# Altium project Audio_Mini.PrjPcb (part 3 of 3)

## Sheet Power.SchDoc: Power Regulation
size 279 x 215 mm; DrawnBy: Connor Dack; Engineer: Connor Dack; DocumentNumber: 7; Revision: 1.0; SheetNumber: 7; SheetTotal: 11
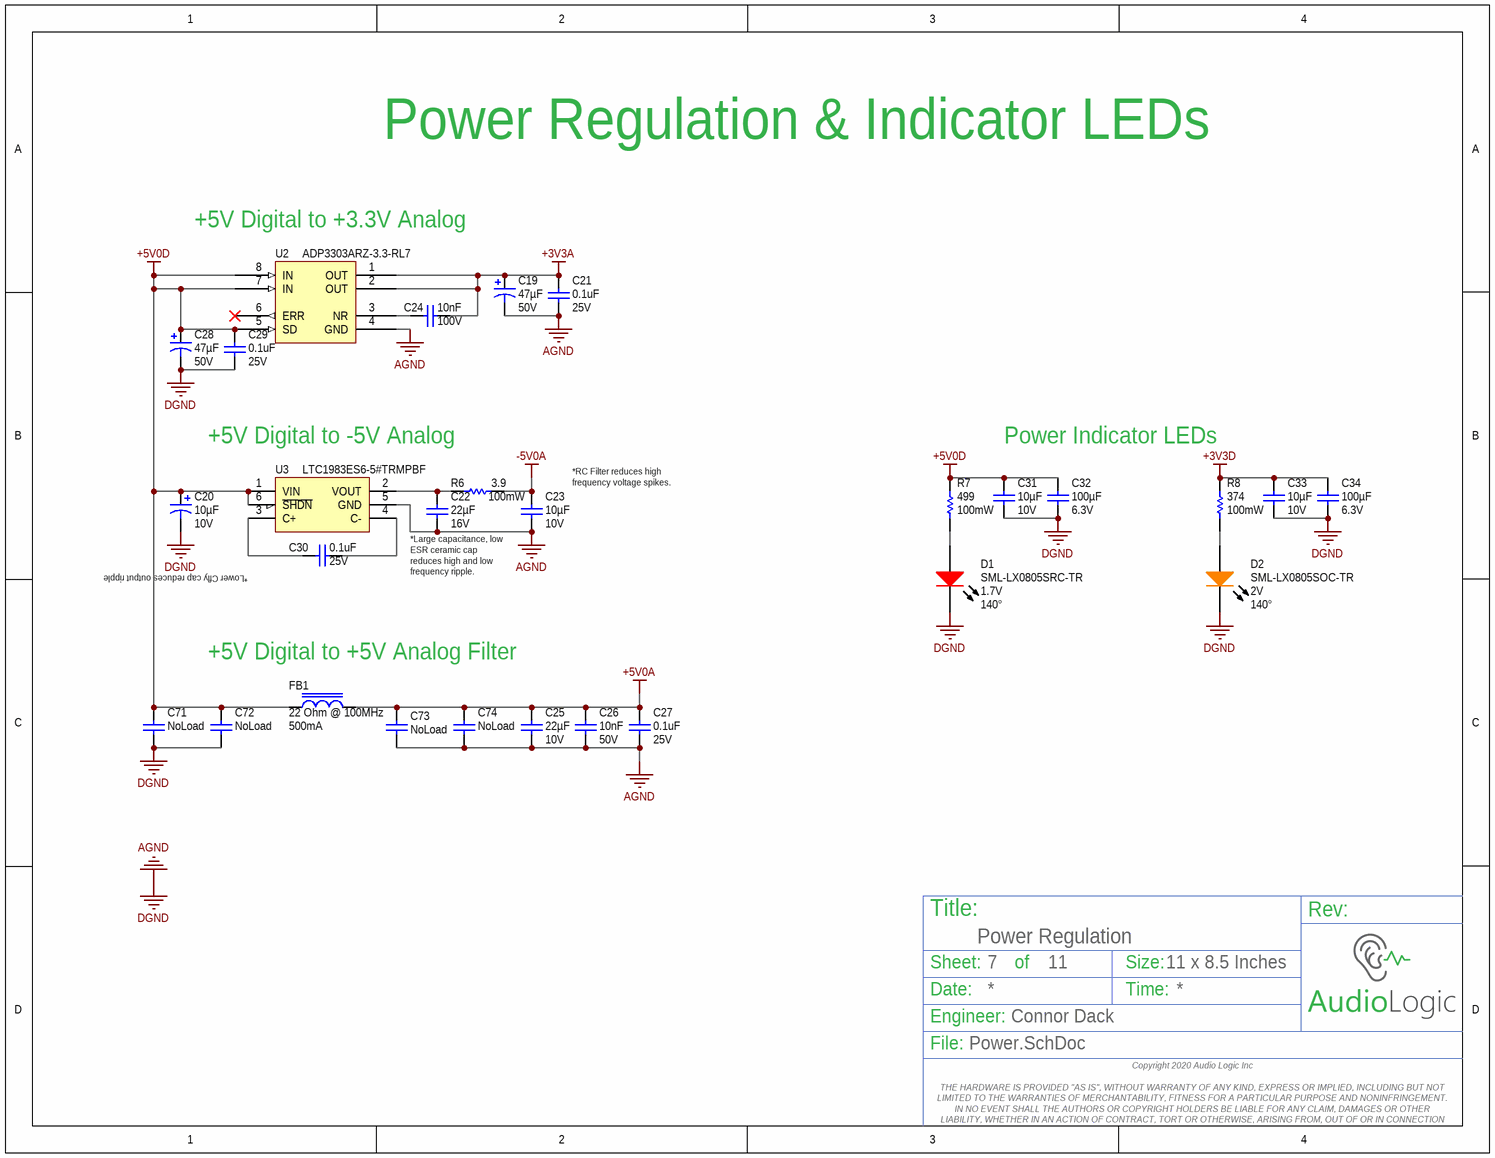
[diagram p9: Power.SchDoc]

### Parts
C19  Voltage Rating: 50V  Capacitance: 47µF  [ALUMCAPC630D_D]  (hidden comment: EEE-FT1H470AP)
C20  Voltage - Rated: 10V  Capacitance: 10µF  [C1206_TANT]  (hidden comment: TPSA106K010R0900)
C21  Voltage Rating: 25V  Capacitance: 0.1uF  [3-0603_L]  (hidden comment: CGA3E2X7R1E104K080AA)
C22  Voltage - Rated: 16V  Capacitance: 22µF  [C1206]  (hidden comment: C3216X6S1C226M)
C23  Voltage - Rated: 10V  Capacitance: 10µF  [3-0603_L]  (hidden comment: C1608X5R1A106K)
C24  Voltage - Rated: 100V  Capacitance: 10nF  [3-0603_L]  (hidden comment: C1608X7R2A103K080AA)
C25  Voltage - Rated: 10V  Capacitance: 22µF  [6-0805_L]  (hidden comment: CL21A226KPCLRNC)
C26  Voltage - Rated: 50V  Capacitance: 10nF  [3-0603_L]  (hidden comment: C0603C103J5RACTU)
C27  Voltage Rating: 25V  Capacitance: 0.1uF  [3-0603_L]  (hidden comment: CGA3E2X7R1E104K080AA)
C28  Voltage Rating: 50V  Capacitance: 47µF  [ALUMCAPC630D_D]  (hidden comment: EEE-FT1H470AP)
C29  Voltage Rating: 25V  Capacitance: 0.1uF  [3-0603_L]  (hidden comment: CGA3E2X7R1E104K080AA)
C30  Voltage Rating: 25V  Capacitance: 0.1uF  [3-0603_L]  (hidden comment: CGA3E2X7R1E104K080AA)
C31  Voltage - Rated: 10V  Capacitance: 10µF  [3-0603_L]  (hidden comment: C1608X5R1A106K)
C32  Voltage - Rated: 6.3V  Capacitance: 100µF  [C1210X25_L]  (hidden comment: CL32X107MQVNNNE)
C33  Voltage - Rated: 10V  Capacitance: 10µF  [3-0603_L]  (hidden comment: C1608X5R1A106K)
C34  Voltage - Rated: 6.3V  Capacitance: 100µF  [C1210X25_L]  (hidden comment: CL32X107MQVNNNE)
C71  Capacitance: NoLoad  [3-0603_L_DNP]  (hidden comment: CAP 0603)
C72  Capacitance: NoLoad  [3-0603_L_DNP]  (hidden comment: CAP 0603)
C73  Capacitance: NoLoad  [3-0603_L_DNP]  (hidden comment: CAP 0603)
C74  Capacitance: NoLoad  [3-0603_L_DNP]  (hidden comment: CAP 0603)
D1  Manufacturer Part Number: SML-LX0805SRC-TR  Voltage - Forward (Vf) (Typ): 1.7V  Viewing Angle: 140°  [DIOM2012X12L_RED]  (hidden comment: LED_RED 4)
D2  Manufacturer Part Number: SML-LX0805SOC-TR  Voltage - Forward (Vf) (Typ): 2V  Viewing Angle: 140°  [DIOM2012X12L_ORANGE]  (hidden comment: LED_ORANGE 3)
FB1  Current Rating: 500mA  Impedance @ Frequency: 22 Ohm @ 100MHz  [3-0603_L]  (hidden comment: BLM18BA220SN1D)
R6  Power (Watts): 100mW  Resistance (Ohms): 3.9  [3-0603_R_L]  (hidden comment: ERJ-3RQF3R9V)
R7  Power (Watts): 100mW  Resistance (Ohms): 499  [3-0603_R_L]  (hidden comment: ERJ-3EKF4990V)
R8  Power (Watts): 100mW  Resistance (Ohms): 374  [3-0603_R_L]  (hidden comment: ERJ-3EKF3740V)
U2  ADP3303ARZ-3.3-RL7  [SOIC127P600X175-8N]
U3  (no value)  [SOT23-6_L]

### Nets
+3V3A: C19.1(P) C21.1 C24.1 U2.1(OUT) U2.2(OUT)
+3V3D: C33.2 C34.2 R8.2
+5V0A: C25.2 C26.2 C27.1 C73.2 C74.2 FB1.2
+5V0D: C20.1(P) C28.1(P) C29.1 C31.2 C32.2 C71.2 C72.2 FB1.1 R7.2 U2.5(SD) U2.7(IN) U2.8(IN) U3.1(VIN) U3.6(~{SHDN})
-5V0A: C23.2 R6.2
AGND: C19.2(N) C20.2(N) C21.2 C22.1 C23.1 C25.1 C26.1 C27.2 C28.2(N) C29.2 C31.1 C32.1 C33.1 C34.1 C71.1 C72.1 C73.1 C74.1 D1.2(K) D2.2(K) U2.4(GND) U3.5(GND)  [also labelled DGND]
NetC22_2: C22.2 R6.1 U3.2(VOUT)
NetC24_2: C24.2 U2.3(NR)
NetC30_1: C30.1 U3.4(C-)
NetC30_2: C30.2 U3.3(C+)
NetD1_1: D1.1(A) R7.1
NetD2_1: D2.1(A) R8.1

Not connected (* = marked no-connect by the designer): U2 6(ERR)*

### Notes on the sheet
- Power Regulation & Indicator LEDs
- +5V Digital to +3.3V Analog
- +5V Digital to -5V Analog
- (near C23) *RC Filter reduces high frequency voltage spikes.
- Power Indicator LEDs
- (near C30) *Lower Cfly cap reduces output ripple
- (near C22) *Large capacitance, low ESR ceramic cap reduces high and low frequency ripple.
- +5V Digital to +5V Analog Filter
- Title:
- Sheet:
- of
- Size:
- 11 x 8.5 Inches
- Rev:
- Date:
- Engineer:
- Time:
- File:
- Copyright 2020 Audio Logic Inc
  THE HARDWARE IS PROVIDED "AS IS", WITHOUT WARRANTY OF ANY KIND, EXPRESS OR IMPLIED, INCLUDING BUT NOT LIMITED TO THE WARRANTIES OF MERCHANTABILITY, FITNESS FOR A PARTICULAR PURPOSE AND NONINFRINGEMENT. IN NO EVENT SHALL THE AUTHORS OR COPYRIGHT HOLDERS BE LIABLE FOR ANY CLAIM, DAMAGES OR OTHER LIABILITY, WHETHER IN AN ACTION OF CONTRACT, TORT OR OTHERWISE, ARISING FROM, OUT OF OR IN CONNECTION WITH THE HARDWARE OR THE USE OR OTHER DEALINGS IN THE HARDWARE.

### Library data of the parts
C19 C28 = EEE-FT1H470AP: CAP ALUM 47UF 50V 20% SMD; Manufacturer: Panasonic - ECG; Lifetime @ Temp.: 2000 Hrs @ 105°C; Ripple Current: 195mA; ESR (Equivalent Series Resistance): 680.0 mOhm; Surface Mount Land Size: 0.260" L x 0.260" W (6.60mm x 6.60mm); Supplier 1: Digi-Key; Manufacturer Part Number: EEE-FT1H470AP; RoHS: RoHS Compliant; Category: Capacitors; Stock 1: 1772; Pricing 1: 1=0.81, 50=0.4834, 100=0.4229, 250=0.33232, 500=0.3021 (USD); Tolerance: ±20%; Operating Temperature: -55°C ~ 105°C; Features: General Purpose; Impedance: -; Mounting Type: Surface Mount; Package / Case: Radial, Can - SMD; Size / Dimension: 0.248" Dia (6.30mm); Height - Seated (Max): 0.240" (6.10mm); Lead Spacing: -; Packaging: Cut Tape (CT); ComponentLink1URL: http://industrial.panasonic.com/www-cgi/jvcr17pz.cgi?E+PZ+4+ABA0134+0+WW; ComponentLink1Description: http://industrial.panasonic.com/www-cgi/jvcr17pz.cgi?E+PZ+4+ABA0134+0+WW; Supplier Part Number 1: PCE5023CT-ND; Load Status: *
C20 = TPSA106K010R0900: CAP TANT 10UF 10V 10% 1206; Manufacturer: AVX Corporation; Manufacturer Size Code: A; ESR (Equivalent Series Resistance): 900 mOhm; Type: Molded; Supplier 1: Digi-Key; Manufacturer Part Number: TPSA106K010R0900; RoHS: RoHS Compliant; Category: Capacitors; Stock 1: 62197; Pricing 1: 1=0.77, 10=0.737, 100=0.3575, 250=0.297, 500=0.2695, 1000=0.2475 (USD); Packaging: Cut Tape (CT); Tolerance: ±10%; Operating Temperature: -55°C ~ 125°C; Mounting Type: Surface Mount; Package / Case: 1206 (3216 Metric); Size / Dimension: 0.126" L x 0.063" W (3.20mm x 1.60mm); Height - Seated (Max): 0.071" (1.80mm); Lead Spacing: -; Features: General Purpose; Lifetime @ Temp.: -; ComponentLink1URL: http://www.avx.com/docs/Catalogs/tps.pdf; ComponentLink1Description: http://www.avx.com/docs/Catalogs/tps.pdf; Supplier Part Number 1: 478-1751-1-ND; Load Status: *
C21 C27 C29 C30 = CGA3E2X7R1E104K080AA: CAP CER 0.1UF 25V X7R 0603; Manufacturer: TDK; Tolerance: 10%; ComponentLink1URL: https://datasheet.ciiva.com/24218/cga3e2x7r1h332k080aa-266003-24218741.pdf; ComponentLink1Description: https://datasheet.ciiva.com/24218/cga3e2x7r1h332k080aa-266003-24218741.pdf; Supplier 1: Digi-Key; Manufacturer Part Number: CGA3E2X7R1E104K080AA; Stock 1: 170098; Pricing 1: 1=0.1, 10=0.063, 100=0.0279, 500=0.0199, 1000=0.0156 (USD); Mount: Surface Mount; Case/Package: 0603; Weight: 7.1E-05oz; Case Code (Metric): 1608; Case Code (Imperial): 0603; Min Operating Temperature: -55°C; Max Operating Temperature: 125°C; Packaging: Tape and Reel; Package Quantity: 1; Voltage Rating (DC): 25V; Dielectric: X7R; Termination: SMD/SMT; Composition: Ceramic; Length: 1.6mm; Height: 0.8mm; Width: 0.031inch; Thickness: 0.035inch; Depth: 0.8mm; REACH SVHC: No SVHC; Lead Free: Lead Free; ComponentLink2URL: https://datasheet.ciiva.com/22725/1735392-22725638.pdf; ComponentLink2Description: https://datasheet.ciiva.com/22725/1735392-22725638.pdf; ComponentLink3URL: https://datasheet.ciiva.com/24220/cga3e2x7r1e104k080aa-265934-24220022.pdf; ComponentLink3Description: https://datasheet.ciiva.com/24220/cga3e2x7r1e104k080aa-265934-24220022.pdf; ComponentLink4URL: https://datasheet.ciiva.com/22725/1735392-22725639.pdf; ComponentLink4Description: https://datasheet.ciiva.com/22725/1735392-22725639.pdf; ComponentLink5URL: https://datasheet.ciiva.com/16427/mlccspec-automotive-general-midvoltage-en-16427320.pdf; ComponentLink5Description: https://datasheet.ciiva.com/16427/mlccspec-automotive-general-midvoltage-en-16427320.pdf; ComponentLink6URL: https://datasheet.ciiva.com/23803/1735392-23803082.pdf; ComponentLink6Description: https://datasheet.ciiva.com/23803/1735392-23803082.pdf; Supplier Part Number 1: 445-5667-6-ND
C22 = C3216X6S1C226M: CAP CER 22UF 16V 20% X6S 1206; Manufacturer: TDK Corporation; Supplier 1: Digi-Key; Manufacturer Part Number: C3216X6S1C226M; RoHS: RoHS Compliant; Category: Capacitors; Stock 1: 4138; Pricing 1: 1=1.13, 10=0.94, 100=0.6, 250=0.5, 500=0.45, 1000=0.41 (USD); Tolerance: ±20%; Temperature Coefficient: X6S; Mounting Type: Surface Mount, MLCC; Operating Temperature: -55°C ~ 105°C; Applications: General Purpose; Ratings: -; Package / Case: 1206 (3216 Metric); Size / Dimension: 0.126" L x 0.063" W (3.20mm x 1.60mm); Height - Seated (Max): -; Thickness (Max): -; Lead Spacing: -; Features: -; Packaging: Cut Tape (CT); Lead Style: -; ComponentLink1URL: http://www.tdk.com/pdf/general_B11.pdf; ComponentLink1Description: http://www.tdk.com/pdf/general_B11.pdf; Supplier Part Number 1: 445-8044-1-ND; Load Status: *
C23 C31 C33 = C1608X5R1A106K: CAP CER 10UF 10V 10% X5R 0603; Manufacturer: TDK Corporation; Supplier 1: Digi-Key; Manufacturer Part Number: C1608X5R1A106K; RoHS: RoHS Compliant; Category: Capacitors; Stock 1: 36523; Pricing 1: 1=0.48, 10=0.42, 100=0.21, 250=0.168, 500=0.153, 1000=0.138 (USD); Tolerance: ±10%; Temperature Coefficient: X5R; Mounting Type: Surface Mount, MLCC; Operating Temperature: -55°C ~ 85°C; Applications: General Purpose; Ratings: -; Package / Case: 0603 (1608 Metric); Size / Dimension: 0.063" L x 0.031" W (1.60mm x 0.80mm); Height - Seated (Max): -; Thickness (Max): 0.035" (0.90mm); Lead Spacing: -; Features: -; Packaging: Cut Tape (CT); Lead Style: -; ComponentLink1URL: http://www.tdk.com/pdf/general_B11.pdf; ComponentLink1Description: http://www.tdk.com/pdf/general_B11.pdf; Supplier Part Number 1: 445-7486-1-ND; Load Status: *
C24 = C1608X7R2A103K080AA: CAP CER 10000PF 100V X7R 0603; Manufacturer: TDK Corporation; Tolerance: ±10%; Supplier 1: Digi-Key; Manufacturer Part Number: C1608X7R2A103K080AA; RoHS: RoHS Compliant; Category: Capacitors; Stock 1: 257721; Pricing 1: 1=0.1, 10=0.06, 100=0.0275, 250=0.02252, 500=0.01926, 1000=0.015 (USD); Packaging: Cut Tape (CT); Temperature Coefficient: X7R; Mounting Type: Surface Mount, MLCC; Operating Temperature: -55°C ~ 125°C; Applications: General Purpose; Ratings: -; Package / Case: 0603 (1608 Metric); Size / Dimension: 0.063" L x 0.031" W (1.60mm x 0.80mm); Height - Seated (Max): -; Thickness (Max): 0.037" (0.95mm); Lead Spacing: -; Features: -; Lead Style: -; ComponentLink1URL: http://product.tdk.com/capacitor/mlcc/en/documents/mlcc_commercial_midvoltage_en.pdf; ComponentLink1Description: http://product.tdk.com/capacitor/mlcc/en/documents/mlcc_commercial_midvoltage_en.pdf; Supplier Part Number 1: 445-1304-1-ND; Load Status: *
C25 = CL21A226KPCLRNC: CAP CER 22UF 10V X5R 0805; Manufacturer: Samsung Electro-Mechanics America, Inc.; Tolerance: ±10%; Supplier 1: Digi-Key; Manufacturer Part Number: CL21A226KPCLRNC; RoHS: RoHS Compliant; Category: Capacitors; Stock 1: 70317; Pricing 1: 1=0.25, 10=0.173, 25=0.1384, 50=0.1154, 100=0.0981, 250=0.07788, 500=0.06924, 1000=0.06059 (USD); Packaging: Cut Tape (CT); Part Status: Active; Temperature Coefficient: X5R; Operating Temperature: -55°C ~ 85°C; Features: Low Profile; Ratings: -; Applications: General Purpose; Failure Rate: *; Mounting Type: Surface Mount, MLCC; Package / Case: 0805 (2012 Metric); Size / Dimension: 0.079" L x 0.049" W (2.00mm x 1.25mm); Height - Seated (Max): -; Thickness (Max): 0.037" (0.95mm); Lead Spacing: -; Lead Style: -; ComponentLink1URL: http://www.samsungsem.com/kr/support/product-search/mlcc/__icsFiles/afieldfile/2016/08/18/S_CL21A226KPCLRNC.pdf; ComponentLink1Description: http://www.samsungsem.com/kr/support/product-search/mlcc/__icsFiles/afieldfile/2016/08/18/S_CL21A226KPCLRNC.pdf; Supplier Part Number 1: 1276-6786-1-ND; Load Status: *
C26 = C0603C103J5RACTU: CAP CER 10000PF 50V 5% X7R 0603; Manufacturer: Kemet; Supplier 1: Digi-Key; Manufacturer Part Number: C0603C103J5RACTU; RoHS: RoHS Compliant; Category: Capacitors; Stock 1: 187680; Pricing 1: 1=0.1, 10=0.036, 50=0.0196, 100=0.0165, 250=0.01352, 500=0.01156, 1000=0.009 (USD); Tolerance: ±5%; Temperature Coefficient: X7R; Mounting Type: Surface Mount, MLCC; Operating Temperature: -55°C ~ 125°C; Applications: General Purpose; Ratings: -; Package / Case: 0603 (1608 Metric); Size / Dimension: 0.063" L x 0.031" W (1.60mm x 0.80mm); Height - Seated (Max): -; Thickness (Max): 0.034" (0.87mm); Lead Spacing: -; Features: -; Packaging: Cut Tape (CT); Lead Style: -; ComponentLink1URL: http://www.kemet.com/datasheets&C0603C103J5RACTU; ComponentLink1Description: http://www.kemet.com/datasheets&C0603C103J5RACTU; Supplier Part Number 1: 399-1092-1-ND; Load Status: *
C32 C34 = CL32X107MQVNNNE: 100µF 6.3V Ceramic Capacitor X6S 1210 (3225 Metric) 0.126" L x 0.098" W (3.20mm x 2.50mm); Manufacturer: Samsung Electro-Mechanics America, Inc.; Tolerance: ±20%; Supplier 1: Digi-Key; Manufacturer Part Number: CL32X107MQVNNNE; RoHS: RoHS Compliant; Category: Capacitors; Stock 1: 19666; Pricing 1: 1=1.35, 10=1.13, 25=0.974, 50=0.914, 100=0.7215, 500=0.54112 (USD); Packaging: Cut Tape (CT); Part Status: Active; Temperature Coefficient: X6S; Mounting Type: Surface Mount, MLCC; Operating Temperature: -55°C ~ 105°C; Applications: General Purpose; Ratings: -; Package / Case: 1210 (3225 Metric); Size / Dimension: 0.126" L x 0.098" W (3.20mm x 2.50mm); Height - Seated (Max): -; Thickness (Max): 0.110" (2.80mm); Lead Spacing: -; Features: -; Lead Style: -; ComponentLink1URL: http://www.samsungsem.com/kr/front/downloadcms.do?path=/kr/support/product-search/mlcc/__icsFiles/afieldfile/2014/11/05&fileName=C_CL32X107MQVNNNE.pdf; ComponentLink1Description: http://www.samsungsem.com/kr/front/downloadcms.do?path=/kr/support/product-search/mlcc/__icsFiles/afieldfile/2014/11/05&fileName=C_CL32X107MQVNNNE.pdf; Supplier Part Number 1: 1276-3399-1-ND; Load Status: *
C71-C74 = CAP 0603: CAP 0603 SMD - NoLoad; Load Status: Do Not Install
D1 = LED_RED 4: LED 660NM SUPER RED CLR 0805 T/R; Manufacturer: Lumex Opto/Components Inc; Millicandela Rating: 25mcd; Current - Test: 20mA; Lens Type: Clear; Supplier 1: Digi-Key; RoHS: RoHS Compliant; Category: Optoelectronics; Stock 1: 1141; Pricing 1: 1=0.56, 10=0.395, 100=0.2596, 250=0.19472, 500=0.177, 1000=0.1416 (USD); Packaging: Cut Tape (CT); Color: Red; Wavelength - Dominant: -; Wavelength - Peak: 660nm; Lens Style/Size: *; Package / Case: 0805 (2012 Metric); Size / Dimension: 2.00mm L x 1.25mm W; Height: 1.10mm; Mounting Type: Surface Mount; Luminous Flux @ Current - Test: -; ComponentLink1URL: http://www.lumex.com/specs/SML-LX0805SRC-TR.pdf; ComponentLink1Description: http://www.lumex.com/specs/SML-LX0805SRC-TR.pdf; Supplier Part Number 1: 67-2191-1-ND; Load Status: *
D2 = LED_ORANGE 3: LED 610NM SUPER ORANGE 0805 SMD; Manufacturer: Lumex Opto/Components Inc; Millicandela Rating: 60mcd; Current - Test: 20mA; Lens Type: Clear; Lens Style/Size: Rectangle with Flat Top, 1.4mm x 1.25mm; Supplier 1: Digi-Key; RoHS: RoHS Compliant; Category: Optoelectronics; Stock 1: 13373; Pricing 1: 1=0.65, 10=0.502, 100=0.3255, 250=0.279, 500=0.2418, 1000=0.186 (USD); Packaging: Cut Tape (CT); Color: Orange; Wavelength - Dominant: -; Wavelength - Peak: 610nm; Package / Case: 0805 (2012 Metric); Size / Dimension: 2.00mm L x 1.25mm W; Height: 1.10mm; Mounting Type: Surface Mount; Luminous Flux @ Current - Test: -; ComponentLink1URL: http://www.lumex.com/specs/SML-LX0805SOC-TR.pdf; ComponentLink1Description: http://www.lumex.com/specs/SML-LX0805SOC-TR.pdf; Supplier Part Number 1: 67-1637-1-ND; Load Status: *
FB1 = BLM18BA220SN1D: FERRITE CHIP 22 OHM 500MA 0603; Manufacturer: Murata Electronics North America; DC Resistance (DCR): 350 mOhm Max; Filter Type: Differential Mode - Single; Supplier 1: Digi-Key; Manufacturer Part Number: BLM18BA220SN1D; RoHS: RoHS Compliant; Category: Filters; Stock 1: 10969; Pricing 1: 1=0.24, 10=0.18, 50=0.105, 100=0.084, 250=0.06, 500=0.0408, 1000=0.033 (USD); Package / Case: 0603 (1608 Metric); Mounting Type: Surface Mount; Packaging: Cut Tape (CT); Height (Max): 0.037" (0.95mm); Size / Dimension: 0.063" L x 0.031" W (1.60mm x 0.80mm); ComponentLink1URL: http://search.murata.co.jp/Ceramy/image/img/PDF/ENG/L0110S0100BLM18B.pdf; ComponentLink1Description: http://search.murata.co.jp/Ceramy/image/img/PDF/ENG/L0110S0100BLM18B.pdf; Supplier Part Number 1: 490-1016-1-ND; Load Status: *
R6 = ERJ-3RQF3R9V: RES 3.9 OHM 1/10W 1% 0603 SMD; Manufacturer: Panasonic Electronic Components; Temperature Coefficient: ±200ppm/°C; Supplier 1: Digi-Key; Manufacturer Part Number: ERJ-3RQF3R9V; RoHS: RoHS Compliant; Category: Resistors; Stock 1: 44573; Pricing 1: 1=0.29, 50=0.1138, 100=0.0878, 250=0.06824, 500=0.0481, 1000=0.0351 (USD); Packaging: Cut Tape (CT); Tolerance: ±1%; Composition: Thick Film; Features: -; Package / Case: 0603 (1608 Metric); Supplier Device Package: 0603; Size / Dimension: 0.063" L x 0.031" W (1.60mm x 0.80mm); Height: 0.022" (0.55mm); Number of Terminations: 2; ComponentLink1URL: http://industrial.panasonic.com/www-cgi/jvcr13pz.cgi?E+PZ+3+AOA0003+ERJ3RQF3R9V+7+WW; ComponentLink1Description: http://industrial.panasonic.com/www-cgi/jvcr13pz.cgi?E+PZ+3+AOA0003+ERJ3RQF3R9V+7+WW; Supplier Part Number 1: P3.9AJCT-ND; Load Status: *
R7 = ERJ-3EKF4990V: RES 499 OHM 1/10W 1% 0603 SMD; Manufacturer: Panasonic - ECG; Temperature Coefficient: ±100ppm/°C; Supplier 1: Digi-Key; Manufacturer Part Number: ERJ-3EKF4990V; RoHS: RoHS Compliant; Category: Resistors; Stock 1: 748630; Pricing 1: 1=0.1, 50=0.0138, 100=0.0105, 250=0.0078, 500=0.00576, 1000=0.00384 (USD); Composition: Thick Film; Features: -; Tolerance: ±1%; Package / Case: 0603 (1608 Metric); Size / Dimension: 0.063" L x 0.031" W (1.60mm x 0.80mm); Height: 0.022" (0.55mm); Number of Terminations: 2; Packaging: Cut Tape (CT); ComponentLink1URL: http://industrial.panasonic.com/www-cgi/jvcr13pz.cgi?E+PZ+3+AOA0002+ERJ3EKF4990V+7+WW; ComponentLink1Description: http://industrial.panasonic.com/www-cgi/jvcr13pz.cgi?E+PZ+3+AOA0002+ERJ3EKF4990V+7+WW; Supplier Part Number 1: P499HCT-ND; Load Status: *
R8 = ERJ-3EKF3740V: RES SMD 374 OHM 1% 1/10W 0603; Manufacturer: Panasonic Electronic Components; Temperature Coefficient: ±100ppm/°C; Supplier 1: Digi-Key; Manufacturer Part Number: ERJ-3EKF3740V; RoHS: RoHS Compliant; Category: Resistors; Stock 1: 48031; Pricing 1: 1=0.1, 50=0.0114, 100=0.0084, 250=0.00644, 500=0.00514, 1000=0.00379 (USD); Packaging: Cut Tape (CT); Part Status: Active; Tolerance: ±1%; Composition: Thick Film; Features: Automotive AEC-Q200; Operating Temperature: -55°C ~ 155°C; Package / Case: 0603 (1608 Metric); Supplier Device Package: 0603; Size / Dimension: 0.063" L x 0.031" W (1.60mm x 0.80mm); Height: 0.022" (0.55mm); Number of Terminations: 2; ComponentLink1URL: http://industrial.panasonic.com/www-cgi/jvcr13pz.cgi?E+PZ+3+AOA0002+ERJ3EKF3740V+7+WW; ComponentLink1Description: http://industrial.panasonic.com/www-cgi/jvcr13pz.cgi?E+PZ+3+AOA0002+ERJ3EKF3740V+7+WW; Supplier Part Number 1: P374HCT-ND; Load Status: *
U2 = ADP3303ARZ-3.3-RL7: Linear Voltage Regulator IC Positive Fixed 1 Output 3.3V 200mA 8-SOIC; Manufacturer: Analog Devices Inc.; Voltage - Dropout (Typical): 0.18V @ 200mA; Number of Regulators: 1; Voltage - Input: Up to 12V; Supplier 1: Digi-Key; RoHS: RoHS Compliant; Category: Integrated Circuits (ICs); Stock 1: 2012; Pricing 1: 1=3.19, 10=2.867, 100=2.3517, 500=2.0007 (USD); Packaging: Cut Tape (CT); Part Status: Active; Regulator Topology: Positive Fixed; Voltage - Output: 3.3V; Current - Output: 200mA; Current - Limit (Min): -; Operating Temperature: -25°C ~ 125°C; Mounting Type: Surface Mount; Package / Case: 8-SOIC (0.154", 3.90mm Width); Supplier Device Package: 8-SOIC; ComponentLink1URL: http://www.analog.com/media/en/technical-documentation/data-sheets/ADP3303.pdf; ComponentLink1Description: http://www.analog.com/media/en/technical-documentation/data-sheets/ADP3303.pdf; Supplier Part Number 1: ADP3303ARZ-3.3-RL7CT-ND; Manufacturer Part Number: ADP3303ARZ-3.3-RL7
U3 = LTC1983ES6-5#TRMPBF: IC REG SWITCHD CAP INV -5V SOT23; Manufacturer: Linear Technology; Output Type: Fixed; Number of Outputs: 1; Voltage - Input: 2.3 V ~ 5.5 V; PWM Type: Burst Mode®; Frequency - Switching: 900kHz; Current - Output: 100mA; Synchronous Rectifier: No; Supplier 1: Digi-Key; RoHS: RoHS Compliant; Category: Integrated Circuits (ICs); Stock 1: 6466; Pricing 1: 1=4.28, 25=3.8192, 100=3.4371 (USD); Packaging: Cut Tape (CT); Type: Switched Capacitor (Charge Pump), Inverting; Voltage - Output: -5V; Operating Temperature: -40°C ~ 85°C; Mounting Type: Surface Mount; Package / Case: SOT-23-6 Thin, TSOT-23-6; Supplier Device Package: TSOT-23-6; ComponentLink1URL: http://www.linear.com/docs/2135; ComponentLink1Description: http://www.linear.com/docs/2135; Supplier Part Number 1: LTC1983ES6-5#TRMPBFCT-ND; Manufacturer Part Number: LTC1983ES6-5#TRMPBF; Load Status: *

## Sheet System_Architecture.SchDoc: System Architecture
size 279 x 215 mm; CompanyName: Flat Earth Inc.; DrawnBy: Connor Dack; Engineer: Connor Dack; Address1: 985 Technology Blvd; Address2: Suite 102; Address3: Bozeman, MT, 59718; DocumentNumber: 3; Revision: 0.0; SheetNumber: 3; SheetTotal: 11
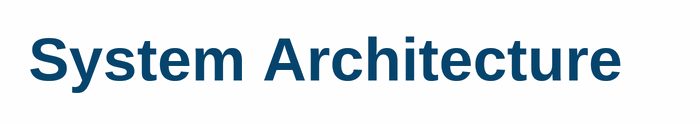
[diagram p10: System_Architecture.SchDoc]

### Notes on the sheet
- System Architecture
- Title:
- Rev:
- Sheet:
- Date:
- of
- Time:
- Size:
- 11 x 8.5 Inches
- Engineer:
- File:
- This document contains confidential and proprietary information belonging to flat earth of Bozeman, Montana.
  This information can not be disclosed to anyone outside of flat earth without written permission from flat earth.

## Nets that join several sheets
+3V3A: Audio_Codec (10 pins), Power (5 pins)
+3V3D: Audio_Input_Digitial_Mic (5 pins), Audio_Output_Headphone (R33.2 R34.2), Support (SW1.1 SW2.1 SW3.1 SW4.1), FPGA_Connectors (JP2.29), Audio_Codec (6 pins), Power (C33.2 C34.2 R8.2)
+5V0A: Audio_Output_Headphone (C69.2 U8.12), Audio_Input_Line_In (6 pins), Power (6 pins)
+5V0D: Audio_Output_Headphone (C64.1 U8.20), FPGA_Connectors (JP2.11), Power (14 pins)
-5V0A: Audio_Input_Line_In (C36.2 C51.2 U4.4 U5.4), Power (C23.2 R6.2)
AGND: Audio_Input_Digitial_Mic (5 pins), Audio_Output_Headphone (10 pins), Support (8 pins), FPGA_Connectors (JP2.12 JP2.30 JP7.12 JP7.30), Audio_Input_Line_In (20 pins), Audio_Codec (31 pins), Power (22 pins)
~{CLATC}H: FPGA_Connectors (JP7.6), Audio_Codec (R3.2 U1.35)
ABCLK: FPGA_Connectors (JP7.3), Audio_Codec (U1.28)
ALRCLK: FPGA_Connectors (JP7.9), Audio_Codec (U1.29)
CCLK: FPGA_Connectors (JP7.5), Audio_Codec (U1.34)
CIN: FPGA_Connectors (JP7.8), Audio_Codec (U1.30)
COUT: FPGA_Connectors (JP7.7), Audio_Codec (R5.2 U1.31)
DBCLK: FPGA_Connectors (JP7.15), Audio_Codec (U1.21)
DIGITAL_MIC_CLK: Audio_Input_Digitial_Mic (U6.1 U7.1), FPGA_Connectors (JP2.21)
DIGITAL_MIC_DATA: Audio_Input_Digitial_Mic (U6.5 U7.5), FPGA_Connectors (JP2.22)
DLRCLK: FPGA_Connectors (JP7.16), Audio_Codec (U1.22)
~{HEADPHONE_PWR_OFF}: Audio_Output_Headphone (U8.6), FPGA_Connectors (JP7.10)
HEADPHONE_OUT_DSDATA: FPGA_Connectors (JP7.18), Audio_Codec (U1.20)
HEADPHONE_OUT_L_N: Audio_Output_Headphone (C66.1), Audio_Codec (U1.37)
HEADPHONE_OUT_L_P: Audio_Output_Headphone (C67.1), Audio_Codec (U1.36)
HEADPHONE_OUT_R_N: Audio_Output_Headphone (C70.1), Audio_Codec (U1.39)
HEADPHONE_OUT_R_P: Audio_Output_Headphone (C68.1), Audio_Codec (U1.38)
LED1: Support (R9.2), FPGA_Connectors (JP7.39)
LED2: Support (R10.2), FPGA_Connectors (JP7.37)
LED3: Support (R13.2), FPGA_Connectors (JP7.35)
LED4: Support (R14.2), FPGA_Connectors (JP7.33)
LINE_IN_DSDATA: FPGA_Connectors (JP7.13), Audio_Codec (U1.26)
LINE_IN_L_N: Audio_Input_Line_In (C43.1 C45.2 R23.2), Audio_Codec (U1.58)
LINE_IN_L_P: Audio_Input_Line_In (C37.2 C43.2 R19.2), Audio_Codec (U1.57)
LINE_IN_R_N: Audio_Input_Line_In (C57.1 C59.2 R32.2), Audio_Codec (U1.60)
LINE_IN_R_P: Audio_Input_Line_In (C52.2 C57.2 R28.2), Audio_Codec (U1.59)
MCLKO: FPGA_Connectors (JP7.1), Audio_Codec (R2.2 U1.3)
NetJP7_2: Audio_Output_Headphone (R33.1 U8.8), FPGA_Connectors (JP7.2)
NetJP7_4: Audio_Output_Headphone (R34.1 U8.7), FPGA_Connectors (JP7.4)
~{RST_CODEC}: FPGA_Connectors (JP7.20), Audio_Codec (R4.2 U1.14)
SW1: Support (R11.1 SW1.2), FPGA_Connectors (JP7.40)
SW2: Support (R12.1 SW2.2), FPGA_Connectors (JP7.38)
SW3: Support (R15.1 SW3.2), FPGA_Connectors (JP7.36)
SW4: Support (R16.1 SW4.2), FPGA_Connectors (JP7.34)

## Assembly variants
Audio_Mini: not fitted C42 C46 C47 C49 C61 C62 C71 C72 C73 C74 P1 R24 R25 R33 R34 U6 U7
Audio_Mini_Microphone_In: not fitted C61 C62 C71 C72 C73 C74 R33 R34 U6 U7; alternate parts C35 -> CL10C040BB8NNNC, C50 -> CL10C040BB8NNNC, R17 -> CRCW04021M78FKED, R26 -> CRCW04021M78FKED
Audio_Mini_with_MEMS_Microphones: not fitted C42 C46 C47 C49 C71 C72 C73 C74 P1 R24 R25 R33 R34